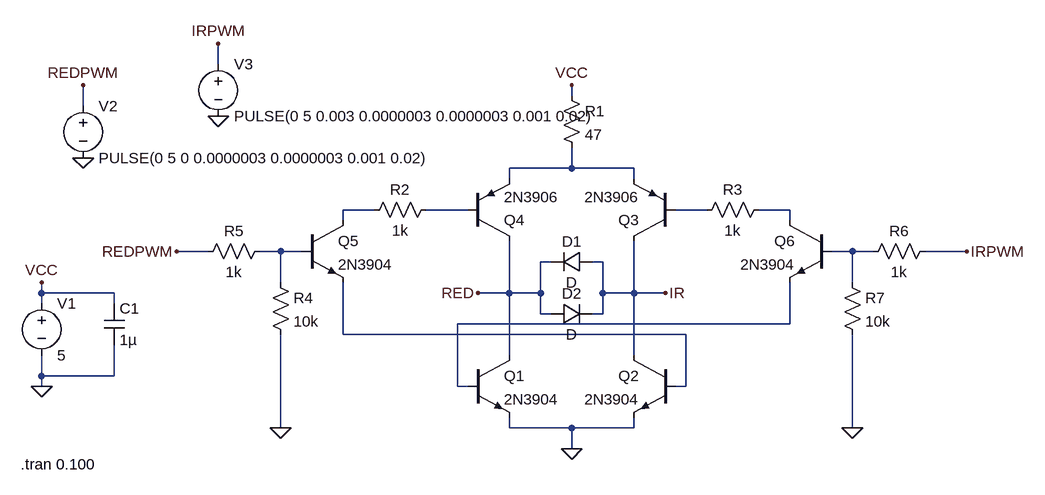
[diagram p0: schematic HBridge-Components.asc]
HBridge-Components.asc, the LTspice schematic file:
Version 4
SHEET 1 944 680
WIRE -320 -32 -320 -64
WIRE 224 16 224 0
WIRE -528 32 -528 0
WIRE 224 128 224 96
WIRE 224 128 128 128
WIRE 320 128 224 128
WIRE 128 144 128 128
WIRE 320 144 320 128
WIRE -80 192 -128 192
WIRE 64 192 0 192
WIRE 432 192 384 192
WIRE 560 192 512 192
WIRE -128 208 -128 192
WIRE 560 208 560 192
WIRE -336 256 -384 256
WIRE -224 256 -256 256
WIRE -192 256 -224 256
WIRE 656 256 624 256
WIRE 688 256 656 256
WIRE 832 256 768 256
WIRE 192 272 176 272
WIRE 272 272 256 272
WIRE -224 304 -224 256
WIRE 656 304 656 256
WIRE -592 320 -592 304
WIRE -480 320 -592 320
WIRE 128 320 128 240
WIRE 128 320 80 320
WIRE 176 320 176 272
WIRE 176 320 128 320
WIRE 272 320 272 272
WIRE 320 320 320 240
WIRE 320 320 272 320
WIRE 368 320 320 320
WIRE -592 336 -592 320
WIRE -480 336 -480 320
WIRE 176 352 176 320
WIRE 192 352 176 352
WIRE 272 352 272 320
WIRE 272 352 256 352
WIRE 560 368 560 304
WIRE 560 368 48 368
WIRE -128 384 -128 304
WIRE 400 384 -128 384
WIRE 128 416 128 320
WIRE 320 416 320 320
WIRE -592 448 -592 416
WIRE -480 448 -480 400
WIRE -480 448 -592 448
WIRE -592 464 -592 448
WIRE 48 464 48 368
WIRE 64 464 48 464
WIRE 400 464 400 384
WIRE 400 464 384 464
WIRE -224 528 -224 384
WIRE 128 528 128 512
WIRE 224 528 128 528
WIRE 320 528 320 512
WIRE 320 528 224 528
WIRE 656 528 656 384
WIRE 224 560 224 528
FLAG 224 560 0
FLAG 656 528 0
FLAG -224 528 0
FLAG -384 256 REDPWM
FLAG 80 320 RED
FLAG 368 320 IR
FLAG 832 256 IRPWM
FLAG -592 464 0
FLAG -592 304 VCC
FLAG 224 0 VCC
FLAG -528 112 0
FLAG -320 48 0
FLAG -528 0 REDPWM
FLAG -320 -64 IRPWM
SYMBOL res 208 0 R0
SYMATTR InstName R1
SYMATTR Value 47
SYMBOL res 16 176 R90
WINDOW 0 0 56 VBottom 2
WINDOW 3 32 56 VTop 2
SYMATTR InstName R2
SYMATTR Value 1k
SYMBOL res 528 176 R90
WINDOW 0 0 56 VBottom 2
WINDOW 3 32 56 VTop 2
SYMATTR InstName R3
SYMATTR Value 1k
SYMBOL npn 64 416 R0
SYMATTR InstName Q1
SYMATTR Value 2N3904
SYMBOL npn 384 416 M0
SYMATTR InstName Q2
SYMATTR Value 2N3904
SYMBOL pnp 384 240 R180
SYMATTR InstName Q3
SYMATTR Value 2N3906
SYMBOL pnp 64 240 M180
SYMATTR InstName Q4
SYMATTR Value 2N3906
SYMBOL npn -192 208 R0
SYMATTR InstName Q5
SYMATTR Value 2N3904
SYMBOL npn 624 208 M0
SYMATTR InstName Q6
SYMATTR Value 2N3904
SYMBOL res -240 288 R0
SYMATTR InstName R4
SYMATTR Value 10k
SYMBOL res -240 240 R90
WINDOW 0 0 56 VBottom 2
WINDOW 3 32 56 VTop 2
SYMATTR InstName R5
SYMATTR Value 1k
SYMBOL res 784 240 R90
WINDOW 0 0 56 VBottom 2
WINDOW 3 32 56 VTop 2
SYMATTR InstName R6
SYMATTR Value 1k
SYMBOL res 640 288 R0
SYMATTR InstName R7
SYMATTR Value 10k
SYMBOL voltage -592 320 R0
WINDOW 123 0 0 Left 2
WINDOW 39 0 0 Left 2
SYMATTR InstName V1
SYMATTR Value 5
SYMBOL voltage -528 16 R0
WINDOW 123 0 0 Left 2
WINDOW 39 0 0 Left 2
SYMATTR InstName V2
SYMATTR Value PULSE(0 5 0 0.0000003 0.0000003 0.001 0.02)
SYMBOL voltage -320 -48 R0
WINDOW 123 0 0 Left 2
WINDOW 39 0 0 Left 2
SYMATTR InstName V3
SYMATTR Value PULSE(0 5 0.003 0.0000003 0.0000003 0.001 0.02)
SYMBOL cap -496 336 R0
SYMATTR InstName C1
SYMATTR Value 1µ
SYMBOL diode 256 256 R90
WINDOW 0 0 32 VBottom 2
WINDOW 3 32 32 VTop 2
SYMATTR InstName D1
SYMBOL diode 192 368 R270
WINDOW 0 32 32 VTop 2
WINDOW 3 0 32 VBottom 2
SYMATTR InstName D2
TEXT -624 584 Left 2 !.tran 0.100

The netlist it stands for:
* HBridge-Components.asc
R1 VCC N001 47
R2 N003 N002 1k
R3 N005 N004 1k
Q1 RED N008 0 0 2N3904
Q2 IR N009 0 0 2N3904
Q3 IR N004 N001 0 2N3906
Q4 RED N003 N001 0 2N3906
Q5 N002 N006 N009 0 2N3904
Q6 N005 N007 N008 0 2N3904
R4 N006 0 10k
R5 N006 REDPWM 1k
R6 IRPWM N007 1k
R7 N007 0 10k
V1 VCC 0 5
V2 REDPWM 0 PULSE(0 5 0 0.0000003 0.0000003 0.001 0.02)
V3 IRPWM 0 PULSE(0 5 0.003 0.0000003 0.0000003 0.001 0.02)
C1 VCC 0 1µ
D1 IR RED D
D2 RED IR D
.model D D
.lib standard.dio
.model NPN NPN
.model PNP PNP
.lib standard.bjt
.tran 0.100
.backanno
.end